# EasyEDA Pro project ProPrj_ESP32DIV-pcbok_mod1_2025-07-15.epro

# Board ESP32DIV-pcb
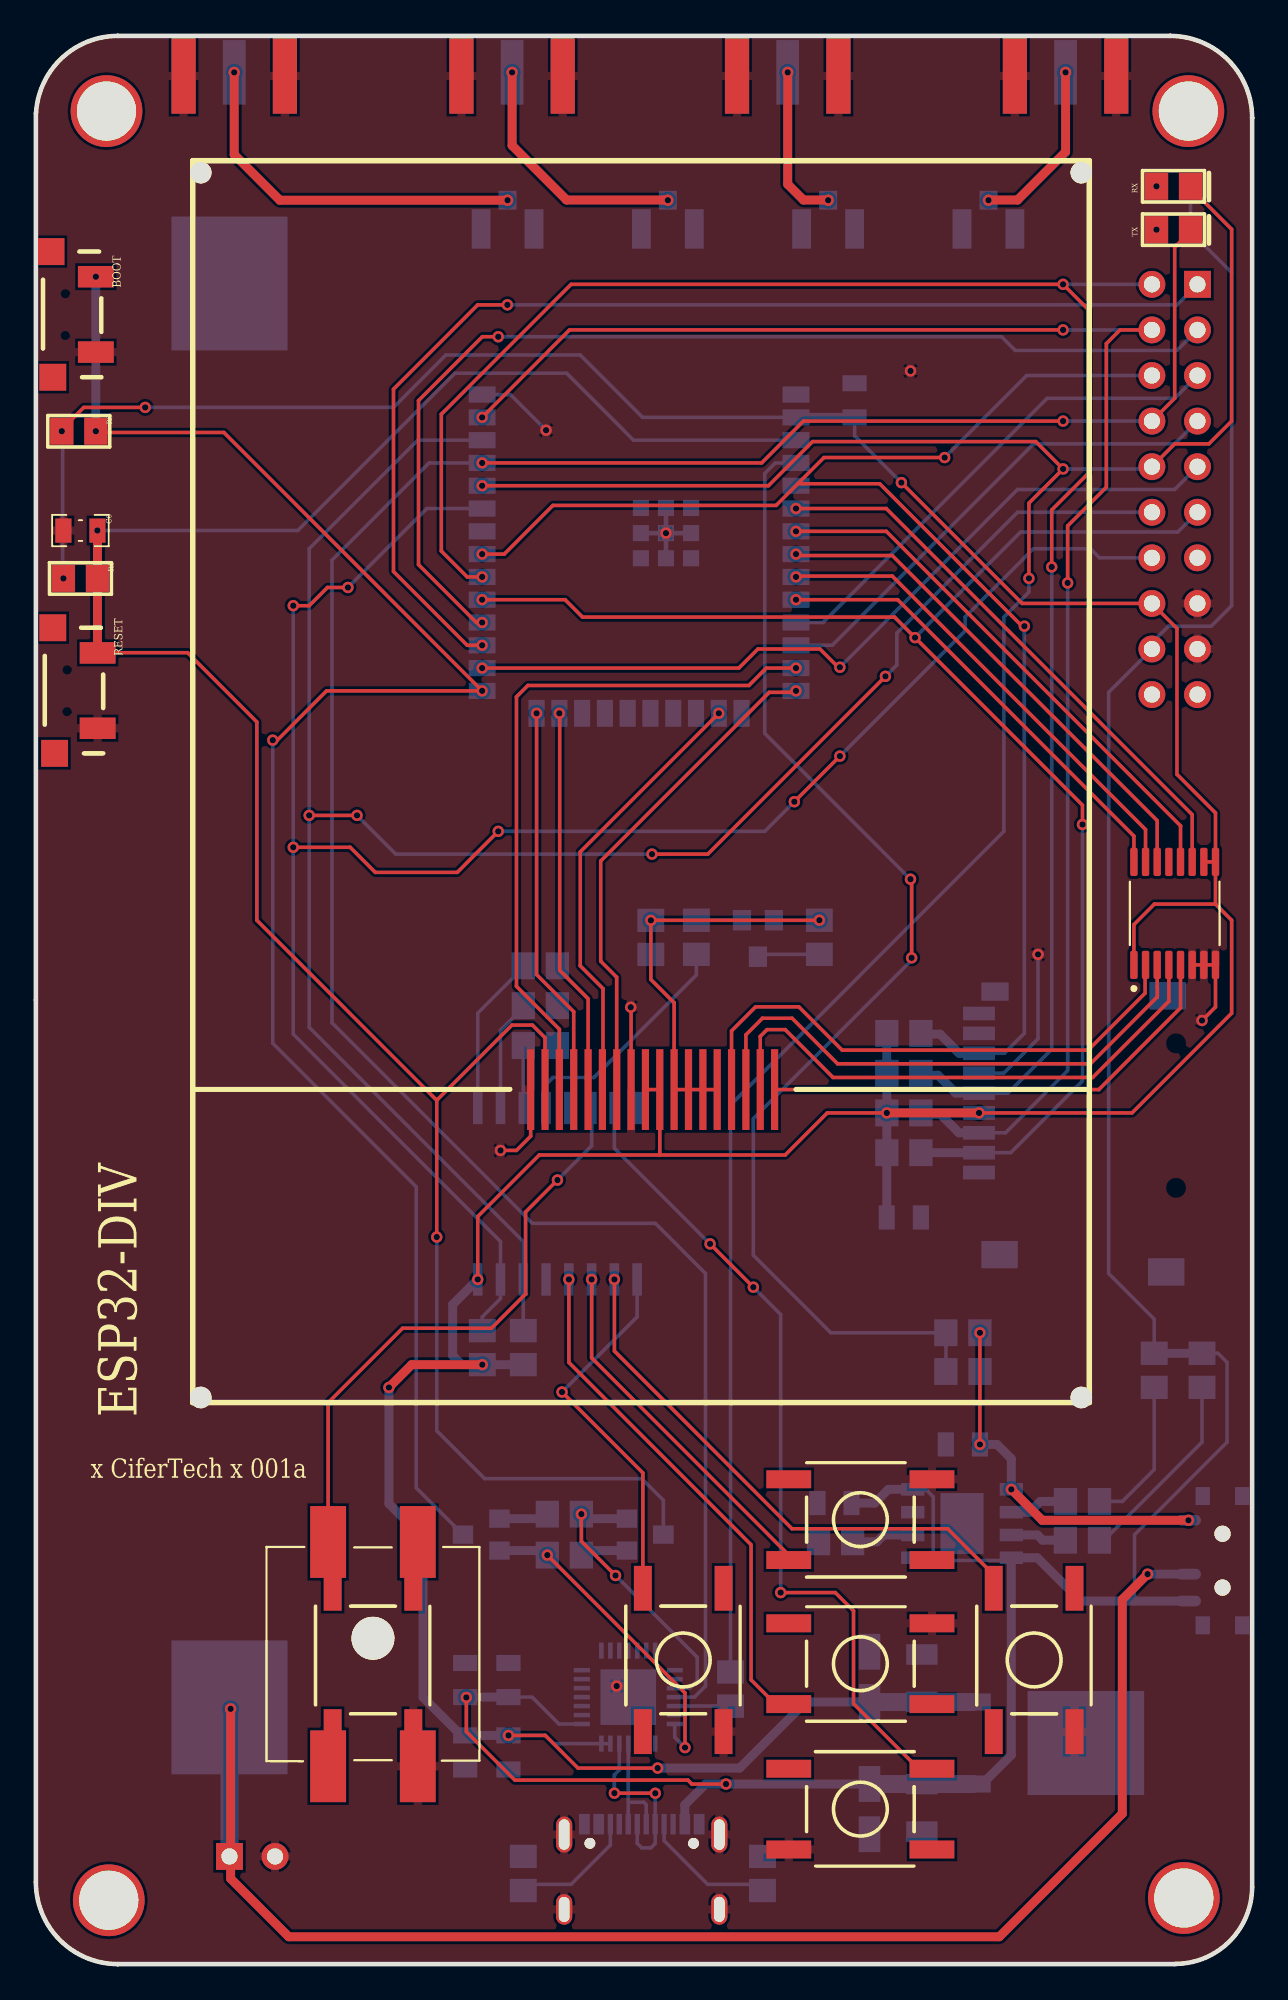
[diagram p0: board, top side]
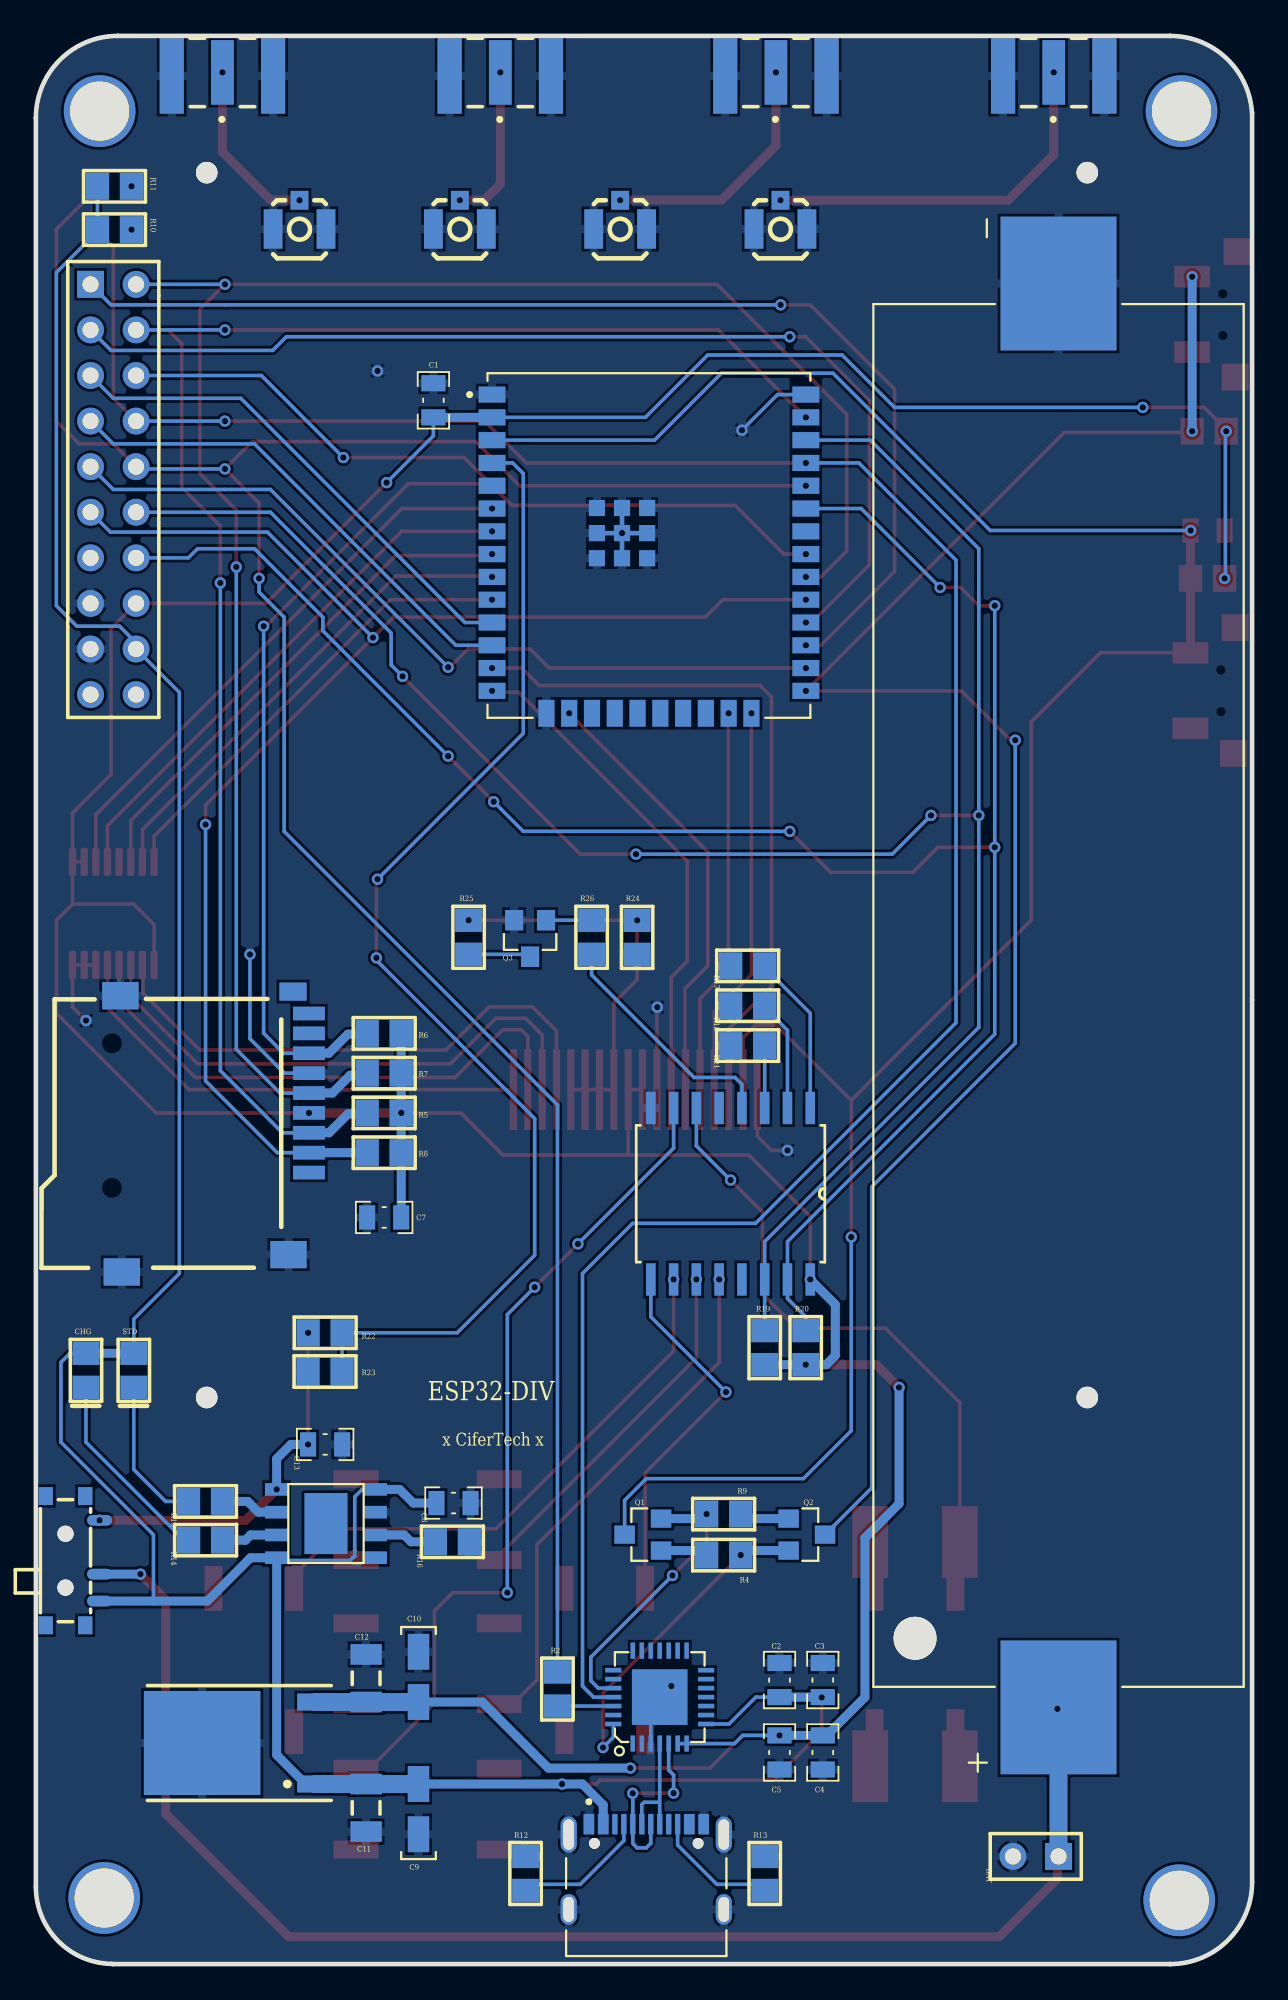
[diagram p1: board, bottom side, seen from below]

Outline 67.82 x 107.44 mm; copper layers: Top Layer, Bottom Layer. Coordinates in mm from the lower left corner of the outline.
Outline path: 0,103.12 arc(0,103.16) 0.01,103.2 arc(1.46,106.22) 4.57,107.44 arc(4.57,107.44) 4.57,107.44 63.25,107.44 arc(63.25,107.44) 63.25,107.44 arc(66.48,106.1) 67.82,102.87 arc(67.82,102.87) 67.82,102.87 67.82,4.31 arc(66.59,1.3) 63.6,0.01 arc(63.56,0) 63.52,0 4.57,0 arc(4.57,0) 4.57,0 arc(1.34,1.34) 0,4.57 0,103.12
Stack: Top Layer 0.0356mm / Dielectric 1 0.32mm FR-4 er 4.8 / Bottom Layer 0.0356mm

## Design rules (mm)
net ANT1: ESP32DIV-sch
net ANT2: ESP32DIV-sch
net ANT3: ESP32DIV-sch
net ANT4: ESP32DIV-sch
net C1: ESP32DIV-sch
net C6: ESP32DIV-sch
net J2: ESP32DIV-sch
net J3: ESP32DIV-sch
net J4: ESP32DIV-sch
net J5: ESP32DIV-sch
net P1: ESP32DIV-sch
net R1: ESP32DIV-sch
net R3: ESP32DIV-sch
net U2: ESP32DIV-sch
net Q3: ESP32DIV-sch
net R17: ESP32DIV-sch
net R18: ESP32DIV-sch
net R19: ESP32DIV-sch
net R20: ESP32DIV-sch
net R21: ESP32DIV-sch
net U5: ESP32DIV-sch
net U6: ESP32DIV-sch
net U7: ESP32DIV-sch
net B1: ESP32DIV-sch
net B2: ESP32DIV-sch
net B3: ESP32DIV-sch
net B4: ESP32DIV-sch
net B5: ESP32DIV-sch
net B6: ESP32DIV-sch
net BT1: ESP32DIV-sch
net C8: ESP32DIV-sch
net C9: ESP32DIV-sch
net C10: ESP32DIV-sch
net C11: ESP32DIV-sch
net C12: ESP32DIV-sch
net C13: ESP32DIV-sch
net IC1: ESP32DIV-sch
net R14: ESP32DIV-sch
net R15: ESP32DIV-sch
net R16: ESP32DIV-sch
net SW1: ESP32DIV-sch
net U4: ESP32DIV-sch
net C7: ESP32DIV-sch
net R5: ESP32DIV-sch
net R6: ESP32DIV-sch
net R7: ESP32DIV-sch
net R8: ESP32DIV-sch
net R10: ESP32DIV-sch
net R11: ESP32DIV-sch
net U1: ESP32DIV-sch
net C2: ESP32DIV-sch
net C3: ESP32DIV-sch
net C4: ESP32DIV-sch
net C5: ESP32DIV-sch
net J1: ESP32DIV-sch
net Q1: ESP32DIV-sch
net Q2: ESP32DIV-sch
net R2: ESP32DIV-sch
net R4: ESP32DIV-sch
net R9: ESP32DIV-sch
net R12: ESP32DIV-sch
net R13: ESP32DIV-sch
net U3: ESP32DIV-sch
net B7: ESP32DIV-sch
net R23: ESP32DIV-sch
net R26: ESP32DIV-sch
net R22: ESP32DIV-sch
net R24: ESP32DIV-sch
net R25: ESP32DIV-sch
net RX: ESP32DIV-sch
net TX: ESP32DIV-sch
net BOOT: ESP32DIV-sch
net RESET: ESP32DIV-sch
net CHG: ESP32DIV-sch
net STD: ESP32DIV-sch
net BAT: ESP32DIV-sch
spacing Clearance (default): track to track 0.254, other pairs 0 to 0.254
track width Width (default): min 0.2, default 0.2, max 1
differential pair DiffPairsRouting (default): width min 0.381, default 0.381, max 0.381; gap min 0.254, default 0.254
via RoutingVias (default): diameter min 1.27, default 1.27, max 1.27; hole min 0.711, default 0.711, max 0.711

## Placement (name value [footprint] x y rotation side)
ANT1  ANT U.FL  [U.FL SMD]  53.12 97.48 0 bottom
ANT2  ANT U.FL  [U.FL SMD]  44.18 97.48 0 bottom
ANT3  ANT U.FL  [U.FL SMD]  35.24 97.48 0 bottom
ANT4  ANT U.FL  [U.FL SMD]  26.3 97.48 0 bottom
B1  Button  [PUSH BUTTON 4 PIN SMD 5]  45.97 8.64 180 top
B2  Button  [PUSH BUTTON 4 PIN SMD 5]  36.1 16.95 270 top
B3  Button  [PUSH BUTTON 4 PIN SMD 5]  55.66 16.95 270 top
B4  Button  [PUSH BUTTON 4 PIN SMD 5]  45.97 24.77 0 top
B5  Button  [PUSH BUTTON 4 PIN SMD 5]  45.97 16.74 0 top
B6  Button  [PUSH BUTTON 4 PIN SMD 5]  18.8 16.95 270 top
B7  Button  [PUSH BUTTON 12*12*8.5mm]  18.8 17.27 90 top
BAT  Battery  [Bat]  -6.1 15.65 0 bottom
BOOT  BUTTON  [PUSH BUTTON SMD]  1.66 91.83 180 top
BT1  1042  [BAT_1042]  10.8 53.98 270 bottom
C1  100nf  [CAP0805]  45.65 87.14 270 bottom
C2  10uf  [CAP0805]  26.35 15.83 270 bottom
C3  100nf  [CAP0805]  23.94 15.83 270 bottom
C4  10uf  [CAP0805]  23.94 11.79 90 bottom
C5  100nf  [CAP0805]  26.35 11.79 90 bottom
C6  100nf  [CAP0805]  2.49 79.88 0 top
C7  100nf  [CAP0805]  48.4 41.6 0 bottom
C8  100nf  [CAP0805]  44.53 25.69 0 bottom
C9  Capacitor Tantalum SMD  [Tan 1206 (3216X18L) Size A]  41.02 1.9 90 bottom
C10  Capacitor Tantalum SMD  [Tan 1206 (3216X18L) Size A]  51.94 22.74 270 bottom
C11  10uf  [CAP 1206 (3216X15L)]  49.4 8.71 90 bottom
C12  10uf  [CAP 1206 (3216X15L)]  49.4 15.93 270 bottom
C13  100nf  [CAP0805]  51.69 28.96 0 bottom
CHG  LED  [L0805]  65.02 32.14 270 bottom
IC1  TP4056  [SOP-8]  51.64 24.55 0 bottom
J1  TYPE-C-31-M-12  [HRO_TYPE-C-31-M-12]  33.78 3.05 180 bottom
J2  SMA  [SAMTEC_SMA-J-P-H-ST-EM1]  57.42 105.41 0 bottom
J3  SMA  [SAMTEC_SMA-J-P-H-ST-EM1]  41.92 105.41 0 bottom
J4  SMA  [SAMTEC_SMA-J-P-H-ST-EM1]  26.55 105.41 0 bottom
J5  SMA  [SAMTEC_SMA-J-P-H-ST-EM1]  11.06 105.41 0 bottom
NOREF  -  [Pad_ie38]  64.01 3.68 0 top
NOREF#2  -  [Pad_ie40]  64.26 103.25 0 top
NOREF#3  -  [Pad_ie37]  3.94 103.25 0 top
NOREF#4  -  [Pad_ie39]  4.06 3.56 0 top
P1  -  [N-Header 10X2]  110.49 166.75 270 bottom
Q1  S8050  [SOT-23]  33.97 23.93 90 bottom
Q2  S8050  [SOT-23]  24.83 23.93 270 bottom
Q3  s8050  [SOT-23]  40.26 57.15 0 bottom
R1  4.7k  [RES 0805]  3.44 77.21 90 top
R2  470  [RES 0805]  38.74 16.28 0 bottom
R3  4.7k  [RES 0805]  3.34 85.42 90 top
R4  12k  [RES 0805]  28.52 22.79 90 bottom
R5  10K  [RES 0805]  49.35 47.43 270 bottom
R6  10K  [RES 0805]  49.35 51.86 270 bottom
R7  10K  [RES 0805]  49.35 49.65 270 bottom
R8  10K  [RES 0805]  49.35 45.21 270 bottom
R9  12k  [RES 0805]  30.42 25.08 270 bottom
R10  1k  [RES 0805]  64.38 96.65 270 bottom
R11  1k  [RES 0805]  64.38 99.06 270 bottom
R12  5.1k  [RES 0805]  40.51 4.1 180 bottom
R13  5.1k  [RES 0805]  27.18 4.1 180 bottom
R14  1k  [RES 0805]  57.4 23.62 90 bottom
R15  1k  [RES 0805]  57.41 25.78 90 bottom
R16  1k  [RES 0805]  45.54 23.53 270 bottom
R17  1k  [RES 0805]  27.18 55.63 90 bottom
R18  1k  [RES 0805]  27.18 53.4 90 bottom
R19  1k  [RES 0805]  27.18 33.4 180 bottom
R20  1k  [RES 0805]  24.89 35.3 0 bottom
R21  1k  [RES 0805]  27.18 51.18 90 bottom
R22  1k  [RES 0805]  52.64 35.18 270 bottom
R23  1k  [RES 0805]  50.74 33.02 90 bottom
R24  10R  [RES 0805]  34.29 58.16 0 bottom
R25  10R  [RES 0805]  43.69 58.17 0 bottom
R26  1k  [RES 0805]  36.83 58.17 0 bottom
RESET  BUTTON  [PUSH BUTTON SMD]  1.76 70.87 180 top
RX  LED  [L0805]  64.38 99.06 0 top
STD  LED  [L0805]  62.36 32.14 270 bottom
SW1  SlideSwitch  [SWSLIDT_SPDT_MSS3]  66.17 22.48 90 bottom
TX  LED  [L0805]  64.38 96.65 0 top
U1  SD CARD SPI MODE  [MICRO SD]  53.23 53.78 270 bottom
U2  ESP32-WROOM-32U  [XCVR_ESP32-WROOM-32U]  33.63 79.05 180 bottom
U3  CP2102  [QFN28G_0.5-5X5MM]  33.03 14.88 90 bottom
U4  LF33  [D-PACK]  52.25 10.03 90 bottom
U5  PCF8574T  [SOIC127P1032X265-16N]  29.08 42.93 270 bottom
U6  2.8 240X320_ILI9341  [LCDTFT_1.8IN_ST7735_18P]  -30.01 47.14 0 top
U7  XPT2046  [TSSOP16]  63.5 58.55 90 top

## Footprints (pads in the part's own frame, mm; a bottom-side part is the same pattern mirrored in y, then rotated)
Bat
  rect 1.5x1.5 hole 0.9: 1(16.891,9.652)
  round 1.5 hole 0.9: 2(19.431,9.652)
BAT_1042
  round 2.39 hole 2.39: (35.82,-8)
  rect 7.46x6.47 smd: N(-39.67,0) P(39.67,0)
CAP0805
  rect 0.9x1.35 smd: 1(-0.95,0) 2(0.95,0)
CAP 1206 (3216X15L)
  rect 1.15x1.75 smd: 1(-1.325,0) 2(1.325,0)
D-PACK
  rect 0.95x2 smd: 1(0,0) 3(4.57,0)
  rect 5.8x6.5 smd: 2(2.285,6.3)
HRO_TYPE-C-31-M-12
  round 0.6 hole 0.6: (-2.89,3.68) (2.89,3.68)
  rect 0.6x1.14 smd: A1_B12(-3.2,4.75) A4_B9(-2.4,4.75) B1_A12(3.2,4.75) B4_A9(2.4,4.75)
  rect 0.3x1.14 smd: A5(-1.25,4.75) A6(-0.25,4.75) A7(0.25,4.75) A8(1.25,4.75) B5(1.75,4.75) B6(0.75,4.75) B7(-0.75,4.75) B8(-1.75,4.75)
  oval 0.9x2 hole 0.6x1.7: S1(-4.325,4.17) S2(4.325,4.17)
  oval 0.9x1.7 hole 0.6x1.4: S3(-4.325,0) S4(4.325,0)
L0805
  rect 1.3x1.5 smd: A(-1.9,0) K(0,0)
LCDTFT_1.8IN_ST7735_18P
  round 1.2 hole 1.2: (39.2,52.685) (39.2,-15.565) (88.3,52.685) (88.3,-15.565)
  rect 0.4x4.5 smd: 1(57.596,1.591) 2(58.397,1.591) 3(59.197,1.591) 4(59.996,1.591) 5(60.797,1.591) 6(61.596,1.591) 7(62.397,1.591) 8(63.197,1.591) 9(63.996,1.591) 10(64.796,1.591) 11(65.597,1.591) 12(66.397,1.591) 13(67.197,1.591) 14(67.996,1.591) 15(68.796,1.591) 16(69.597,1.591) 17(70.397,1.591) 18(71.197,1.591)
MICRO SD
  round 0.003 hole 1.3: (2.475,-10.35) (10.525,-10.35)
  rect 0.762x1.778 smd: 1(9.675,0.636) 2(8.567,0.636) 3(7.459,0.636) 4(6.351,0.636) 5(5.243,0.636) 6(4.135,0.636) 7(3.026,0.636) 8(1.919,0.636) 9(0.81,0.636)
  rect 1.524x2.032 smd: 6(-0.18,-9.879) 6(14.247,-0.506) 6(15.213,-9.803)
  rect 1.016x1.524 smd: 10(-0.408,-0.253)
N-Header 10X2
  rect 1.5x1.5 hole 0.9: 1(73.152,45.72)
  round 1.5 hole 0.9: 2(73.152,48.26) 3(75.692,45.72) 4(75.692,48.26) 5(78.232,45.72) 6(78.232,48.26) 7(80.772,45.72) 8(80.772,48.26) 9(83.312,45.72) 10(83.312,48.26) 11(85.852,45.72) 12(85.852,48.26) 13(88.392,45.72) 14(88.392,48.26) 15(90.932,45.72) 16(90.932,48.26) 17(93.472,45.72) 18(93.472,48.26) 19(96.012,45.72) 20(96.012,48.26)
Pad_ie37
  round 4 hole 3.3: 1(0,0)
Pad_ie38
  round 4 hole 3.3: 4(0,0)
Pad_ie39
  round 4 hole 3.3: 3(0,0)
Pad_ie40
  round 4 hole 3.3: 2(0,0)
PUSH BUTTON 4 PIN SMD 5
  rect 2.5x1 smd: 1(-3.993,2.25) 2(-3.993,-2.25) 3(3.993,-2.25) 4(3.993,2.25)
PUSH BUTTON 12*12*8.5mm
  rect 4x2 smd: 1(-6.25,2.5) 2(-6.25,-2.5) 3(6.25,-2.5) 4(6.25,2.5)
PUSH BUTTON SMD
  round 0.003 hole 0.7: (0.012,-1.245) (0.02,1.079)
  rect 1.5x1.5 smd: 1(0.712,3.405) 4(0.812,-3.595)
  rect 2x1.2 smd: 2(-1.688,2.005) 3(-1.688,-2.195)
QFN28G_0.5-5X5MM
  rect 0.9x0.254 smd: 1(-2.59,1.5) 2(-2.59,1) 3(-2.59,0.5) 4(-2.59,0) 5(-2.59,-0.5) 6(-2.59,-1) 7(-2.59,-1.5) 15(2.59,-1.5) 16(2.59,-1) 17(2.59,-0.5) 18(2.59,0) 19(2.59,0.5) 20(2.59,1) 21(2.59,1.5)
  rect 0.254x0.9 smd: 8(-1.5,-2.59) 9(-1,-2.59) 10(-0.5,-2.59) 11(0,-2.59) 12(0.5,-2.59) 13(1,-2.59) 14(1.5,-2.59) 22(1.5,2.59) 23(1,2.59) 24(0.5,2.59) 25(0,2.59) 26(-0.5,2.59) 27(-1,2.59) 28(-1.5,2.59)
  rect 3.1x3.1 smd: 29(0,0)
RES 0805
  rect 1.5x1.3 smd: 1(0,0) 2(0,1.9)
SAMTEC_SMA-J-P-H-ST-EM1
  rect 1.27x3.6 smd: 1(0,0)
  rect 1.35x4.2 smd: 2_1(-2.825,0.2) 3_1(2.825,0.2)
  rect 1.35x4.2 smd far side: 2_2(-2.825,0.2) 3_2(2.825,0.2)
SOIC127P1032X265-16N
  rect 1.804x0.533 smd: 1(-4.775,4.445) 2(-4.775,3.175) 3(-4.775,1.905) 4(-4.775,0.635) 5(-4.775,-0.635) 6(-4.775,-1.905) 7(-4.775,-3.175) 8(-4.775,-4.445) 9(4.775,-4.445) 10(4.775,-3.175) 11(4.775,-1.905) 12(4.775,-0.635) 13(4.775,0.635) 14(4.775,1.905) 15(4.775,3.175) 16(4.775,4.445)
SOP-8
  rect 1.3x0.7 smd: 1(-2.75,1.905) 2(-2.75,0.635) 3(-2.75,-0.635) 4(-2.75,-1.905) 5(2.75,-1.905) 6(2.75,-0.635) 7(2.75,0.635) 8(2.75,1.905)
SOT-23
  rect 1.016x1.143 smd: 1(-0.889,-1.016) 2(0.889,-1.016) 3(0,1.016)
SWSLIDT_SPDT_MSS3
  round 0.9 hole 0.9: (-1.5,0) (1.5,0)
  oval 0.6x1.4 smd: 1(2.25,-1.9) 2(-0.75,-1.9) 3(-2.25,-1.9)
  rect 1x0.8 smd: EP(-3.6,-1.1) EP(-3.6,1.1) EP(3.6,-1.1) EP(3.6,1.1)
Tan 1206 (3216X18L) Size A
  rect 1.999x1.199 smd: 1(5.334,5.461) 2(8.133,5.461)
TSSOP16
  rrect 1.57x0.41 smd: 1(-2.87,2.275) 2(-2.87,1.625) 3(-2.87,0.975) 4(-2.87,0.325) 5(-2.87,-0.325) 6(-2.87,-0.975) 7(-2.87,-1.625) 8(-2.87,-2.275) 9(2.87,-2.275) 10(2.87,-1.625) 11(2.87,-0.975) 12(2.87,-0.325) 13(2.87,0.325) 14(2.87,0.975) 15(2.87,1.625) 16(2.87,2.275)
U.FL SMD
  rect 1x1.05 smd: 1(0.002,-0.8)
  rect 1.05x2.2 smd: 2(-1.475,0.8) 2(1.475,0.8)
XCVR_ESP32-WROOM-32U
  rect 1.5x0.9 smd: 1(-8.75,8.41) 2(-8.75,7.14) 3(-8.75,5.87) 4(-8.75,4.6) 5(-8.75,3.33) 6(-8.75,2.06) 7(-8.75,0.79) 8(-8.75,-0.48) 9(-8.75,-1.75) 10(-8.75,-3.02) 11(-8.75,-4.29) 12(-8.75,-5.56) 13(-8.75,-6.83) 14(-8.75,-8.1) 25(8.75,-8.1) 26(8.75,-6.83) 27(8.75,-5.56) 28(8.75,-4.29) 29(8.75,-3.02) 30(8.75,-1.75) 31(8.75,-0.48) 32(8.75,0.79) 33(8.75,2.06) 34(8.75,3.33) 35(8.75,4.6) 36(8.75,5.87) 37(8.75,7.14) 38(8.75,8.41)
  rect 0.9x1.5 smd: 15(-5.715,-9.35) 16(-4.445,-9.35) 17(-3.175,-9.35) 18(-1.905,-9.35) 19(-0.635,-9.35) 20(0.635,-9.35) 21(1.905,-9.35) 22(3.175,-9.35) 23(4.445,-9.35) 24(5.715,-9.35)
  rect 0.9x0.9 smd: 39_1(-2.9,2.09) 39_2(-1.5,2.09) 39_3(-0.1,2.09) 39_4(-2.9,0.69) 39_5(-1.5,0.69) 39_6(-0.1,0.69) 39_7(-2.9,-0.71) 39_8(-1.5,-0.71) 39_9(-0.1,-0.71)

## Nets
3V3: C1.2 C4.2 C5.2 C7.1 C10.2 C12.2 P1.16 R1.2 R3.2 R5.2 R6.2 R7.2 R8.2 R19.1 R20.2 U1.4 U2.2 U3.6 U3.7 U4.3 U5.16 U6.9 U6.10 U7.1 U7.9 U7.10
+5V: C2.2 C3.2 C8.2 C9.2 C11.2 CHG.A IC1.4 IC1.8 J1.A4_B9 P1.18 R10.1 R11.1 STD.A SW1.3 U3.8 U4.1
GND: ANT1.2 ANT2.2 ANT3.2 ANT4.2 B1.4 B2.4 B3.4 B4.4 B5.4 B6.4 B7.2 BAT.2 BOOT.2 BT1.N C1.1 C2.1 C3.1 C4.1 C5.1 C6.1 C7.2 C8.1 C9.1 C10.1 C11.1 C12.1 C13.1 IC1.3 J1.A1_B12 J1.B1_A12 J1.S1 J1.S2 J1.S3 J1.S4 J2.2_1 J2.2_2 J2.3_1 J2.3_2 J3.2_1 J3.2_2 J3.3_1 J3.3_2 J4.2_1 J4.2_2 J4.3_1 J4.3_2 J5.2_1 J5.2_2 J5.3_1 J5.3_2 P1.15 P1.17 Q3.2 R12.2 R13.2 R16.2 R17.2 R18.2 R21.2 R23.2 R24.2 RESET.2 U1.6 U2.1 U2.15 U2.38 U2.39_1 U2.39_2 U2.39_3 U2.39_4 U2.39_5 U2.39_6 U2.39_7 U2.39_8 U2.39_9 U3.3 U3.29 U4.2 U5.8 U6.1 U6.8 U7.6 U7.7 U7.8
ACTIVE: U3.11
BACKLIGHT: R26.2 U5.4
BAT: C13.2 IC1.5 R22.1 SW1.1
BUTTON_1: B1.2 U5.7
BUTTON_2: B2.2 U5.9
BUTTON_3: B3.2 U5.10
BUTTON_4: B4.2 U5.11
BUTTON_5: B5.2 U5.12
BUTTON_6: B6.2 B7.4 U5.6
CC1: J1.A5 R12.1
CC2: J1.B5 R13.1
CLK: P1.2 R7.1 U1.5 U2.30
CS: P1.11 R8.1 U1.2 U2.29
CTS: U3.23
D+: J1.A6 J1.B6 U3.4
D-: J1.A7 J1.B7 U3.5
DCD: U3.1
DSR: U3.27
DTR: Q2.2 R4.1 U3.28
GPIO0: BOOT.3 Q2.3 R3.1 U2.25
IO2: U2.24 U6.4
IO4: P1.9 U2.26
IO12: U2.14 U6.7
IO13: U2.16 U6.6
IO14: U2.13 U6.3
IO15: U2.23 U6.5
IO16: P1.1 U2.27
IO17: P1.3 U2.28
IO19: P1.6 R6.1 U1.7 U2.31
IO21: P1.14 R20.1 U2.33 U5.15
IO22: P1.12 R19.2 U2.36 U5.14
IO23: P1.4 R5.1 U1.3 U2.37
IO25: U2.10 U7.16
IO26: P1.5 U2.11
IO27: P1.7 U2.12
IO32: U2.8 U7.14
IO33: U2.9 U7.15
IO34: U2.6 U7.11
IO35: U2.7 U7.12
IO36: R22.2 R23.1 U2.4
IO39: U2.5
NETANT1_1: ANT1.1 J2.1
NETANT2_1: ANT2.1 J3.1
NETANT3_1: ANT3.1 J4.1
NETANT4_1: ANT4.1 J5.1
NETBT1_P: BAT.1 BT1.P SW1.2
NETCHG1_K: CHG.K R14.2
NETIC1_2: IC1.2 R16.1
NETIC1_6: IC1.6 R15.1
NETIC1_7: IC1.7 R14.1
NETQ1_1: Q1.1 R4.2
NETQ2_1: Q2.1 R9.2
NETQ3_1: Q3.1 R26.1
NETQ3_3: Q3.3 R25.2
NETR2_2: R2.2 U3.26
NETR10_2: R10.2 TX.A
NETR11_2: R11.2 RX.A
NETR15_2: R15.2 STD.K
NETR17_1: R17.1 U5.1
NETR18_1: R18.1 U5.2
NETR21_1: R21.1 U5.3
NETR24_1: R24.1 R25.1 U6.11 U6.12 U6.13 U6.14
RESET: C6.2 Q1.3 R1.1 RESET.3 U2.3 U6.2
RI: U3.2
RTS: Q1.2 R9.1 U3.24
RX_0: P1.10 R2.1 RX.K U2.34
TX_0: P1.8 TX.K U2.35 U3.25
X+: U6.17 U7.4
X-: U6.15 U7.2
Y+: U6.16 U7.3
Y-: U6.18 U7.5

Pads without a net: B1 1 3; B2 1 3; B3 1 3; B4 1 3; B5 1 3; B6 1 3; B7 1 3; BOOT 1 4; IC1 1; J1 A8 B4_A9 B8; NOREF 4; NOREF#2 2; NOREF#3 1; NOREF#4 3; P1 13 19 20; RESET 1 4; SW1 EP; U1 1 8 9 10; U2 17 18 19 20 21 22 32; U3 9 10 12 13 14 15 16 17 18 19 20 21 22; U5 5 13; U7 13

## Via types
v1: diameter 0.635, hole 0.356, Top Layer to Bottom Layer, 104 vias

## Routing (per net, layer and track width the routed paths; a pad name or vN(x,y) marks a point on that pad's centre or on a via; arc(x,y) is an arc through that point)
3V3: length 247.2
  Top Layer w0.2: v1(47.45,47.43) 44.13,47.43 41.78,45.09 34.8,45.09 ; U6.9 U6.10 34.79,45.09 34.8,45.09 ; U7.10 U7.9 ; U7.9 65.78,64.15 63.63,66.29 63.63,74.42 P1.16 54.99,75.82 v1(48.26,82.55) ; U7.9 65.78,59.07 ; 34.8,45.09 28.07,45.09 24.64,41.66 v1(24.64,38.15) ; U7.1 61.23,57.92 62.37,59.07 65.78,59.07 ; v1(1.44,85.42) 1.44,85.52 2.67,86.74 v1(6.1,86.74) ; v1(52.59,47.43) 61.12,47.43 66.68,52.99 66.68,58.17 65.78,59.07 ; v1(26.35,12.74) 28.41,12.74 30.23,10.92 v1(34.67,10.92)
  Top Layer w0.5: v1(19.69,32.13) 20.96,33.4 v1(24.89,33.4) ; v1(47.45,47.43) v1(52.59,47.43)
  Bottom Layer w0.2: U2.2 33.83,86.19 30.35,89.66 22.86,89.66 19.94,86.74 v1(6.1,86.74) ; v1(1.54,77.21) 1.49,77.26 1.49,85.37 v1(1.44,85.42) ; C1.2 45.65,85.16 v1(48.26,82.55) ; v1(26.35,12.74) 28.41,12.74 28.86,12.29 U3.7 U3.6
  Bottom Layer w0.5: C10.2 42.93,14.6 39.24,10.92 v1(34.67,10.92) ; C7.1 R8.2 v1(47.45,47.43) R7.2 R6.2 ; v1(26.35,12.74) C4.2 23.71,12.74 21.59,14.87 21.59,23.75 19.69,25.65 v1(19.69,32.13) ; v1(24.64,38.15) 23.24,36.75 23.24,33.91 23.75,33.4 v1(24.89,33.4) R19.1 ; U2.2 C1.2
  Bottom Layer w1: U4.3 C12.2 C10.2
+5V: length 170.8
  Top Layer w0.2: v1(38.48,10.03) 36.58,10.03 36.36,10.25 26.71,10.25 24,12.95 v1(24,14.86)
  Bottom Layer w0.2: 61.26,20.23 61.26,23.92 66.42,29.08 66.42,33.53 65.91,34.04 CHG.A ; STD.A 62.36,35.94 59.82,38.48 59.82,70.87 P1.18 62.23,73.63 63.15,74.55 65.53,74.55 66.68,75.69 66.68,94.26 64.38,96.55 R10.1 R11.1 ; C2.2 27.67,14.88 29.17,13.38 U3.8 ; IC1.4 48.93,26.42 49.66,26.42 50.04,26.04 50.04,22.75 50.3,22.49 54.24,22.49 IC1.8
  Bottom Layer w0.5: 52.25,10.03 52.77,10.03 54.39,11.65 IC1.8 55.84,22.64 58.26,20.23 SW1.3 ; J1.A4_B9 36.18,8.87 37.34,10.03 C9.2 ; STD.A CHG.A ; C3.2 C2.2 ; IC1.4 47.53,26.45 46.77,25.69 C8.2
  Bottom Layer w1: C9.2 49.4,10.03 ; 49.4,10.03 52.25,10.03
GND: length 35.5
  Top Layer w0.2: v1(25.91,45.34) 26.8,45.34 27.59,46.13 U6.1 ; U7.6 U7.7 U7.8 65.78,53.33 v1(65.02,52.58) ; v1(33.17,53.32) 33.19,53.3 U6.8
  Bottom Layer w0.2: U2.38 26.46,87.46 v1(28.45,85.47) ; U1.6 53.96,49.65 55.88,51.56 v1(55.88,56.26) ; U3.3 33.53,14.38 U3.29
  Bottom Layer w0.254: U2.39_2 v1(35.13,79.74) ; v1(35.13,79.74) U2.39_4 ; v1(35.13,79.74) U2.39_6 ; v1(35.13,79.74) U2.39_8
  vias: v1(32.39,15.49) v1(48.77,88.77)
BACKLIGHT: length 13.4
  Bottom Layer w0.2: R26.2 36.83,55.12 31.12,49.4 28.83,49.4 28.45,49.02 28.45,47.7
BAT: length 20.6
  Top Layer w0.2: v1(52.64,28.96) v1(52.64,35.18)
  Top Layer w0.5: v1(64.27,24.73) 56.12,24.73 v1(54.39,26.45)
  Bottom Layer w0.5: v1(54.39,26.45) 54.39,28.16 53.59,28.96 v1(52.64,28.96)
BUTTON_1: length 46.4
  Top Layer w0.2: v1(41.53,20.7) 44.58,20.7 45.59,19.69 45.59,14.51 49.22,10.89 B1.2 ; v1(37.59,40.13) v1(40.01,37.72)
  Bottom Layer w0.2: v1(37.59,40.13) 32.26,45.47 32.26,47.7 ; v1(40.01,37.72) 41.53,36.2 v1(41.53,20.7)
BUTTON_2: length 20.8
  Top Layer w0.2: B2.2 33.85,27.37 v1(29.34,31.88)
  Bottom Layer w0.2: v1(29.34,31.88) 33.53,36.07 U5.9
BUTTON_3: length 31.1
  Top Layer w0.2: B3.2 53.41,21.69 50.84,24.26 42.16,24.26 32.26,34.16 v1(32.26,38.15)
BUTTON_4: length 20.2
  Top Layer w0.2: B4.2 41.98,22.79 30.99,33.78 v1(30.99,38.15)
BUTTON_5: length 29.2
  Top Layer w0.2: B5.2 41.23,14.49 39.88,15.84 39.88,23.37 29.72,33.53 v1(29.72,38.15)
BUTTON_6: length 35.6
  Top Layer w0.2: B6.2 16.55,23.4 ; v1(29.08,43.69) 27.31,41.91 27.31,37.34 25.4,35.43 20.45,35.43 16.3,31.28 B7.4
  Bottom Layer w0.2: 30.99,47.7 30.99,45.59 v1(29.08,43.69)
CC1: length 7.6
  Bottom Layer w0.2: J1.A5 35.03,6.87 37.46,4.45 40.17,4.45 R12.1
CC2: length 7.1
  Bottom Layer w0.2: R13.1 27.52,4.45 29.85,4.45 32.03,6.63 J1.B5
CLK: length 105.9
  Top Layer w0.2: v1(56.64,77.85) 56.64,81.03 58.67,83.06 58.67,92.2 v1(57.28,93.6) 29.85,93.6 22.61,86.36 22.61,78.74 24.05,77.3 v1(24.88,77.3)
  Bottom Layer w0.2: v1(56.64,77.85) 56.64,50.97 54.21,48.54 U1.5 ; v1(57.28,93.6) P1.2
  Bottom Layer w0.5: R7.1 49.46,49.53 50.29,49.53 51.29,48.54 U1.5
CS: length 82.9
  Top Layer w0.2: v1(24.88,76.03) 29.51,76.03 30.48,75.06 47.88,75.06 v1(49.02,73.91) 58.36,64.58 v1(58.36,63.5)
  Bottom Layer w0.2: U1.2 54.36,45.21 58.36,49.21 v1(58.36,63.5) ; P1.11 63.67,79.8 54.9,79.8 v1(49.02,73.91)
  Bottom Layer w0.5: R8.1 U1.2
D+: length 6.5
  Bottom Layer w0.2: J1.A6 34.03,8.89 33.9,9.02 33.15,9.02 ; J1.B6 U3.4
D-: length 10.2
  Top Layer w0.2: v1(34.54,9.52) 34.54,9.52 32.26,9.52 v1(32.26,9.53)
  Bottom Layer w0.2: J1.A7 33.53,6.73 33.78,6.48 34.29,6.48 34.53,6.72 J1.B7 34.53,9.51 v1(34.54,9.52) 34.54,9.53 ; U3.5 32.53,10.82 32.26,10.54 v1(32.26,9.53)
DTR: length 18.2
  Top Layer w0.2: v1(36.2,12.07) 36.2,15.11 v1(28.52,22.79)
  Bottom Layer w0.2: U3.28 35.62,12.64 v1(36.2,12.07)
  Bottom Layer w0.5: v1(28.52,22.79) 28.26,23.04 Q2.2
GPIO0: length 97.9
  Top Layer w0.2: v1(13.21,68.2) 13.46,68.2 16.21,70.95 v1(24.88,70.95) 10.49,85.34 3.51,85.34 3.34,85.18 v1(3.34,85.42)
  Bottom Layer w0.2: v1(13.21,68.2) 13.21,51.31 21.21,43.31 21.21,26.54 23.34,24.4 23.34,24.34 23.75,23.93 Q2.3
  Bottom Layer w0.5: v1(3.34,85.42) v1(3.34,94.02)
IO2: length 21.8
  Top Layer w0.2: U6.4 29.99,53.07 27.92,55.14 v1(27.92,69.7)
IO4: length 45.4
  Top Layer w0.2: v1(44.83,72.26) 44.78,72.22 43.72,73.28 40.26,73.28 39.2,72.22 v1(24.88,72.22)
  Bottom Layer w0.2: P1.9 63.5,82.17 54.74,82.17 v1(44.83,72.26)
IO12: length 27.9
  Top Layer w0.2: v1(42.38,70.95) 42.3,70.87 40.89,70.87 31.5,61.47 31.5,55.88 32.39,54.99 32.39,48.73 U6.7
IO13: length 24.7
  Top Layer w0.2: v1(38.08,69.7) 30.35,61.97 30.35,55.63 31.62,54.36 31.62,48.76 U6.6
IO14: length 39.1
  Top Layer w0.2: U6.3 29.19,52.09 26.8,54.48 26.8,70.61 27.43,71.25 39.76,71.25 40.73,72.22 v1(42.38,72.22)
IO15: length 21.6
  Top Layer w0.2: U6.5 30.79,53.79 29.21,55.37 29.21,69.68 v1(29.19,69.7)
IO16: length 64.1
  Top Layer w0.2: v1(26.29,92.46) 24.64,92.46 19.94,87.76 19.94,77.6 24.05,73.49 v1(24.88,73.49)
  Bottom Layer w0.2: P1.1 63.63,92.46 v1(26.29,92.46)
IO17: length 59.7
  Top Layer w0.2: v1(25.78,90.68) 24.89,90.68 21.34,87.12 21.34,77.98 24.56,74.76 v1(24.88,74.76)
  Bottom Layer w0.2: v1(25.78,90.68) 53.85,90.68 54.61,89.92 63.63,89.92 P1.3
IO19: length 86.8
  Top Layer w0.2: 42.48,82.49 41.28,81.28 28.83,81.28 26.12,78.57 v1(24.88,78.57) ; 42.48,82.49 43.94,83.95 v1(50.67,83.95) ; 42.48,82.49 47.05,82.49 54.99,74.55 v1(55.12,74.55)
  Bottom Layer w0.2: U1.7 54,50.75 55.12,51.87 v1(55.12,74.55) ; v1(50.67,83.95) 55.25,88.52 P1.6
  Bottom Layer w0.5: R6.1 49.39,51.82 50.42,51.82 51.48,50.75 U1.7
IO21: length 115
  Top Layer w0.2: v1(42.29,64.77) v1(44.83,67.31) ; v1(14.35,75.69) 15.24,75.69 16.26,76.71 v1(17.4,76.71) ; v1(25.78,63.12) 23.5,60.83 18.92,60.83 17.53,62.23 v1(14.35,62.23)
  Bottom Layer w0.2: v1(44.83,67.31) 51.82,74.3 51.82,75.06 55.63,78.87 58.8,78.87 59.31,78.36 P1.14 ; v1(42.29,64.77) 40.64,63.12 v1(25.78,63.12) ; v1(14.35,75.69) v1(14.35,62.23) 14.35,51.82 25.91,40.26 U5.15 25.91,37.08 24.89,36.07 R20.1 ; U2.33 21.8,81.11 v1(17.4,76.71)
IO22: length 117.5
  Top Layer w0.2: v1(47.37,71.76) 37.47,61.85 v1(34.35,61.85) 34.29,61.85 ; v1(15.24,64.01) v1(17.91,64.01)
  Bottom Layer w0.2: v1(17.91,64.01) 20.07,61.85 v1(34.35,61.85) ; P1.12 54.74,80.9 48.01,74.17 48.01,72.39 v1(47.37,71.76) ; U2.36 21.29,84.92 15.24,78.87 v1(15.24,64.01) 15.24,52.2 27.18,40.26 U5.14 R19.2
IO23: length 93.7
  Top Layer w0.2: P1.4 60.45,91.06 59.69,90.3 59.69,82.3 57.53,80.14 v1(57.53,76.96) ; v1(24.88,86.19) 29.76,91.06 v1(57.28,91.06)
  Bottom Layer w0.2: v1(57.53,76.96) 57.53,49.78 54.07,46.32 U1.3 ; v1(57.28,91.06) P1.4
  Bottom Layer w0.5: U1.3 51.47,46.32 50.42,47.37 49.41,47.37 R5.1
IO25: length 25.7
  Top Layer w0.2: U7.16 61.23,62.85 48.05,76.03 v1(42.38,76.03)
IO26: length 28.1
  Bottom Layer w0.2: P1.5 63.5,87.25 56.39,87.25 43.9,74.76 U2.11
IO27: length 27.6
  Bottom Layer w0.2: P1.7 63.5,84.71 55.63,84.71 44.4,73.49 U2.12
IO32: length 28.6
  Top Layer w0.2: U7.14 62.53,63.71 47.75,78.49 42.46,78.49 v1(42.38,78.57)
IO33: length 27.2
  Top Layer w0.2: v1(42.38,77.3) 42.43,77.34 47.75,77.34 61.88,63.22 U7.15
IO34: length 31.8
  Top Layer w0.2: U7.11 64.48,64.05 47.42,81.11 v1(42.38,81.11)
IO35: length 30.2
  Top Layer w0.2: v1(42.38,79.84) 47.42,79.84 63.83,63.43 U7.12
IO36: length 67.3
  Top Layer w0.2: v1(48.77,60.45) 48.83,60.39 v1(48.83,56.07)
  Bottom Layer w0.2: v1(48.77,60.45) 40.64,68.58 40.64,83.06 41.23,83.65 U2.4 ; R23.1 50.74,35.17 R22.2 44.32,35.18 40.01,39.5 40.01,47.12 48.83,55.94 v1(48.83,56.07)
NETANT1_1: length 9.8
  Top Layer w0.5: v1(53.12,98.29) 53.13,98.3 54.74,98.3 57.42,100.98 v1(57.42,105.41)
NETANT2_1: length 8.9
  Top Layer w0.5: v1(44.18,98.29) 44.16,98.3 42.8,98.3 41.92,99.18 v1(41.92,105.41)
NETANT3_1: length 14
  Top Layer w0.5: v1(35.24,98.29) 35.23,98.3 29.59,98.3 26.55,101.34 v1(26.55,105.41)
NETANT4_1: length 20.9
  Top Layer w0.5: v1(26.3,98.29) 13.6,98.29 11.06,100.83 v1(11.06,105.41)
NETBT1_P: length 87.9
  Top Layer w0.5: v1(61.99,21.73) 60.58,20.32 60.58,8.38 53.72,1.52 14.1,1.52 10.86,4.76 v1(10.86,14.22) 10.8,14.22
  Bottom Layer w0.5: SW1.2 v1(61.99,21.73) 61.98,21.72
  Bottom Layer w1: v1(10.86,14.22) 10.8,14.16 BAT.1
NETCHG1_K: length 11
  Bottom Layer w0.2: R14.2 59.56,23.62 65.02,29.08 CHG.K
NETIC1_2: length 3.5
  Bottom Layer w0.5: R16.1 46.9,23.53 47.28,23.91 IC1.2
NETIC1_6: length 3.3
  Bottom Layer w0.5: R15.1 56.01,25.78 55.41,25.18 IC1.6
NETIC1_7: length 3.1
  Bottom Layer w0.5: R14.1 56.13,23.62 55.84,23.91 IC1.7
NETQ1_1: length 2.6
  Bottom Layer w0.5: R4.2 30.67,23.04 Q1.1
NETQ2_1: length 2.8
  Bottom Layer w0.5: R9.2 28.26,24.82 Q2.1
NETQ3_1: length 2.5
  Bottom Layer w0.2: R26.1 Q3.1
NETQ3_3: length 3.5
  Bottom Layer w0.2: Q3.3 40.39,56.27 R25.2
NETR2_2: length 3.1
  Bottom Layer w0.2: U3.26 R2.2
NETR10_2:
  vias: v1(62.48,96.65)
NETR11_2:
  vias: v1(62.48,99.06)
NETR15_2: length 8.4
  Bottom Layer w0.2: R15.2 60.58,25.78 62.36,27.56 STD.K
NETR17_1: length 9
  Bottom Layer w0.2: R17.1 27.18,55.53 24.64,52.99 24.64,47.7
NETR18_1: length 6.2
  Bottom Layer w0.2: R18.1 27.18,53.3 25.91,52.03 25.91,47.7
NETR21_1: length 3.5
  Bottom Layer w0.2: 27.18,47.7 R21.1
NETR24_1: length 21.8
  Top Layer w0.2: v1(43.69,58.17) 43.69,58.16 34.29,58.16 v1(34.29,58.16) 34.29,54.86 35.59,53.57 U6.11 U6.12 U6.13 U6.14
RESET: length 132.2
  Top Layer w0.2: 3.44,73.07 8.46,73.07 12.32,69.22 12.32,58.17 22.35,48.13 ; 22.35,48.13 26.54,52.32 27.69,52.32 28.39,51.62 U6.2 ; 22.35,48.13 v1(22.35,40.51)
  Top Layer w0.5: C6.2 R1.1 3.44,73.07
  Bottom Layer w0.2: v1(3.43,79.88) 14.61,79.88 23.37,88.65 29.59,88.65 33.32,84.92 U2.3 ; v1(22.35,40.51) 22.35,29.72 25.02,27.05 33.78,27.05 34.99,25.85 Q1.3
RTS: length 16
  Top Layer w0.2: v1(32.32,21.65) 30.42,23.56 v1(30.42,25.08)
  Bottom Layer w0.2: U3.24 36.46,15.38 36.87,15.79 36.87,17.1 v1(32.32,21.65)
  Bottom Layer w0.5: v1(30.42,25.08) 30.67,24.82 Q1.2
RX_0: length 133.3
  Top Layer w0.2: P1.10 63.5,84.71 65.41,84.71 66.68,85.98 66.68,96.67 64.38,98.96 RX.K ; v1(24.88,82.38) 40.85,82.38 43.31,84.84 55.75,84.84 v1(57.28,83.31) 55.37,81.41 v1(55.37,77.22)
  Bottom Layer w0.2: v1(57.28,83.31) 62.1,83.31 P1.10 ; v1(55.37,77.22) 55.37,76.45 53.98,75.06 53.98,63.12 38.74,47.88 R2.1
TX_0: length 137.8
  Top Layer w0.2: TX.K 64.38,96.55 63.5,95.66 63.5,87.25 P1.8 ; v1(57.28,85.98) 42.8,85.98 40.47,83.65 v1(24.88,83.65)
  Bottom Layer w0.2: v1(57.28,85.98) P1.8 ; v1(24.88,83.65) 21.92,83.65 16.51,78.23 16.51,52.45 27.69,41.28 34.54,41.28 37.34,38.48 37.34,15.49 36.72,14.88 U3.25
X+: length 30.8
  Top Layer w0.2: U6.17 40.39,51.69 40.77,52.07 41.78,52.07 44.45,49.4 58.93,49.4 63.18,53.65 U7.4
X-: length 30.8
  Top Layer w0.2: U6.15 38.79,52 40.13,53.34 42.55,53.34 44.96,50.93 58.67,50.93 61.85,54.1 61.85,55.65 U7.2
Y+: length 30.8
  Top Layer w0.2: U7.3 62.53,54.44 62.53,54.44 62.53,53.89 58.8,50.17 44.7,50.17 42.16,52.71 40.51,52.71 39.59,51.78 U6.16
Y-: length 26.9
  Top Layer w0.2: U7.5 63.83,53.28 59.27,48.73 U6.18

## Copper pours and planes (outline as drawn; the poured copper is in the pictures)
GND on Top Layer: 4.57,0 1.34,1.34 0,4.57 0,103.12 0,103.16 0.01,103.2 1.46,106.22 4.57,107.44 63.25,107.44 66.48,106.1 67.82,102.87 67.82,4.31 66.59,1.3 63.6,0.01 63.56,0 63.52,0
GND on Bottom Layer: 4.57,0 1.34,1.34 0,4.57 0,103.12 0,103.16 0.01,103.2 1.46,106.22 4.57,107.44 63.25,107.44 66.48,106.1 67.82,102.87 67.82,4.31 66.59,1.3 63.6,0.01 63.56,0 63.52,0

## Text on the board
Bottom Silkscreen Layer: x CiferTech x | ESP32-DIV
Top Silkscreen Layer: x CiferTech x 001a | ESP32-DIV
